# EAGLE design atmega1284_tactile2 (EAGLE 7.1.0)
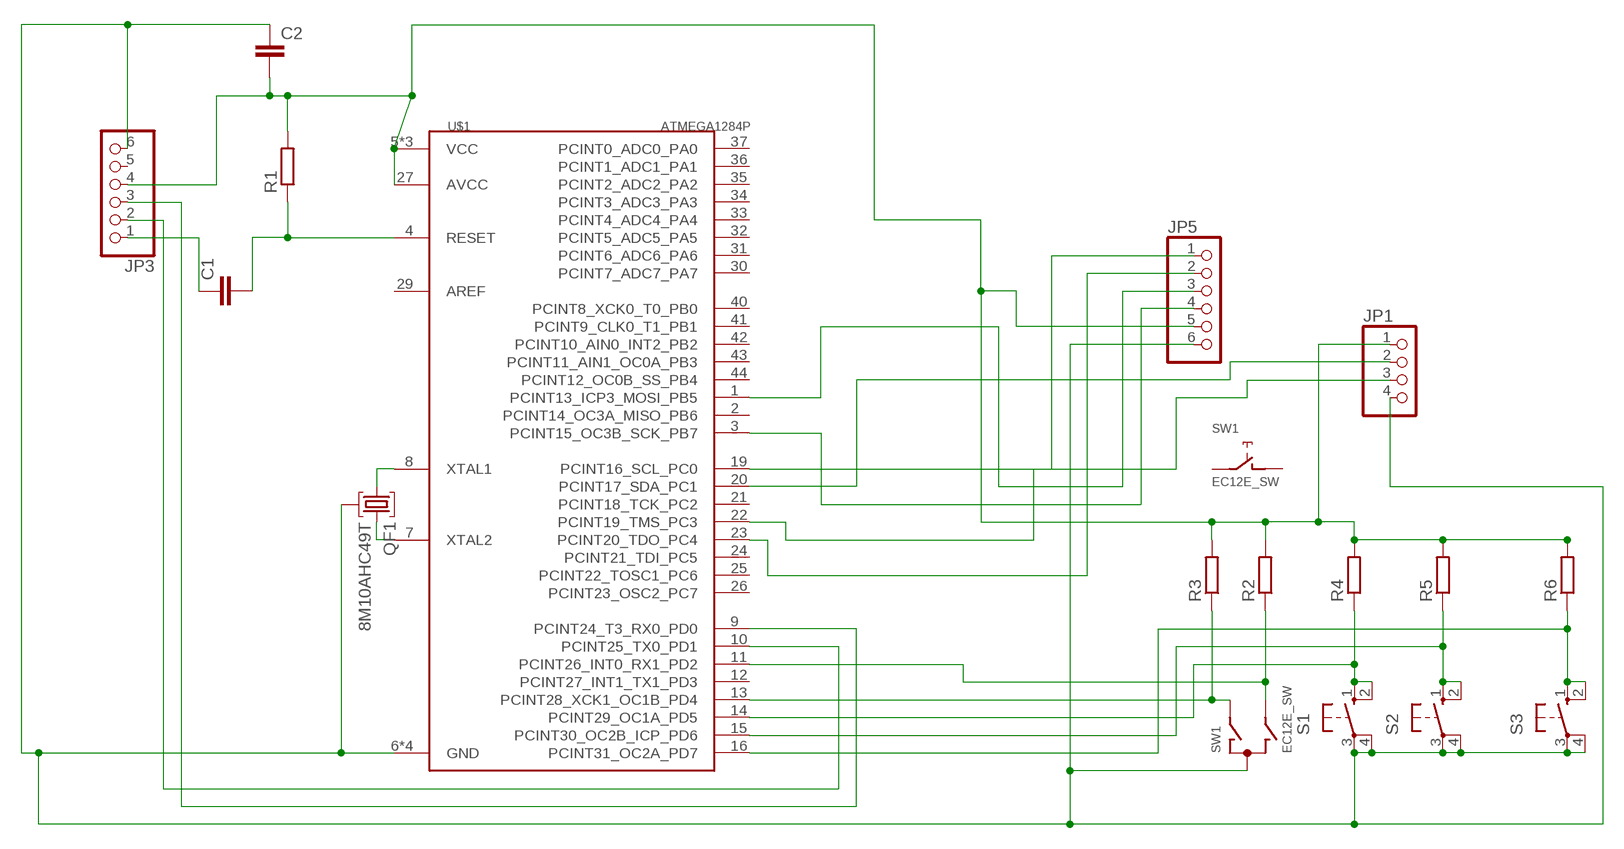
[diagram p0: schematic, sheet 1]

## Parts
C1  C-EUC0805  [C0805]
C2  C-EUC0805  [C0805]
JP1  PINHD-1X4  [1X04]
JP3  PINHD-1X6  [1X06]
JP5  PINHD-1X6  [1X06]
QF1  8M10AHC49T  [HC49U]
R1  R-EU_R0805  [R0805]
R2  R-EU_R0805  [R0805]
R3  R-EU_R0805  [R0805]
R4  R-EU_R0805  [R0805]
R5  R-EU_R0805  [R0805]
R6  R-EU_R0805  [R0805]
S1  10-XX  [B3F-10XX]
S2  10-XX  [B3F-10XX]
S3  10-XX  [B3F-10XX]
SW1  EC12E_SW  [ALPS_EC12E_SW]
U$1  ATMEGA1284P  [TQFP44]

## Nets
N$3: JP5.3 U$1.1(PCINT13_ICP3_MOSI_PB5)
N$5: QF1.1 U$1.8(XTAL1)
N$6: QF1.3 U$1.7(XTAL2)
N$7: C2.1 JP1.4 JP3.6 JP5.6 QF1.2 S1.3(P) S1.4(P1) S2.3(P) S2.4(P1) S3.3(P) S3.4(P1) SW1.C U$1.6(GND) U$1.18(GND) U$1.28(GND) U$1.39(GND)
N$8: JP5.4 U$1.3(PCINT15_OC3B_SCK_PB7)
N$9: R2.1 SW1.B U$1.11(PCINT26_INT0_RX1_PD2)
N$10: C1.2 R1.1 U$1.4(RESET)
N$11: C1.1 JP3.1
N$12: JP3.2 U$1.10(PCINT25_TX0_PD1)
N$13: JP3.3 U$1.9(PCINT24_T3_RX0_PD0)
N$14: JP5.1 U$1.22(PCINT19_TMS_PC3)
N$15: JP5.2 U$1.23(PCINT20_TDO_PC4)
N$16: R3.1 SW1.A U$1.13(PCINT28_XCK1_OC1B_PD4)
N$21: R4.1 S1.1(S) S1.2(S1) U$1.14(PCINT29_OC1A_PD5)
N$22: R5.1 S2.1(S) S2.2(S1) U$1.15(PCINT30_OC2B_ICP_PD6)
N$23: R6.1 S3.1(S) S3.2(S1) U$1.16(PCINT31_OC2A_PD7)
N$24: C2.2 JP1.1 JP3.4 JP5.5 R1.2 R2.2 R3.2 R4.2 R5.2 R6.2 U$1.5(VCC) U$1.17(VCC) U$1.27(AVCC) U$1.38(VCC)
N$29: JP1.2 U$1.20(PCINT17_SDA_PC1)
N$30: JP1.3 U$1.19(PCINT16_SCL_PC0)
Unconnected: JP3.5 SW1.D SW1.E SW1.GND1(G) SW1.GND2(G) U$1.2(PCINT14_OC3A_MISO_PB6) U$1.12(PCINT27_INT1_TX1_PD3) U$1.21(PCINT18_TCK_PC2) U$1.24(PCINT21_TDI_PC5) U$1.25(PCINT22_TOSC1_PC6) U$1.26(PCINT23_OSC2_PC7) U$1.29(AREF) U$1.30(PCINT7_ADC7_PA7) U$1.31(PCINT6_ADC6_PA6) U$1.32(PCINT5_ADC5_PA5) U$1.33(PCINT4_ADC4_PA4) U$1.34(PCINT3_ADC3_PA3) U$1.35(PCINT2_ADC2_PA2) U$1.36(PCINT1_ADC1_PA1) U$1.37(PCINT0_ADC0_PA0) U$1.40(PCINT8_XCK0_T0_PB0) U$1.41(PCINT9_CLK0_T1_PB1) U$1.42(PCINT10_AIN0_INT2_PB2) U$1.43(PCINT11_AIN1_OC0A_PB3) U$1.44(PCINT12_OC0B_SS_PB4)

## Library data of the parts
C1 C2 = rcl:C-EU: CAPACITOR, European symbol
JP1 = pinhead:PINHD-1X4: PIN HEADER
JP3 JP5 = pinhead:PINHD-1X6: PIN HEADER
QF1 = crystal:8M10AHC49T: Monolithic Crystal Filters Source: www.vanlong.com; OC_FARNELL: unknown; OC_NEWARK: unknown
R1-R6 = rcl:R-EU_: RESISTOR, European symbol
S1-S3 = switch-omron:10-XX: OMRON SWITCH; MPN: B3F-1000; OC_FARNELL: 176432; OC_NEWARK: 36M3542
SW1 = switch-alps:EC12E_SW: ALPS rotary Encoder EC12E series with switch; MPN: EC12E2424407; OC_FARNELL: 1520813; OC_NEWARK: 74M1068
U$1 = Stephanie_Parts:ATMEGA1284P: My version schematic & footprint for the ATMega1284P TQFP-44 package. Matches digikey part ATMEGA1284P-AU-ND. Tested & working.

## Board
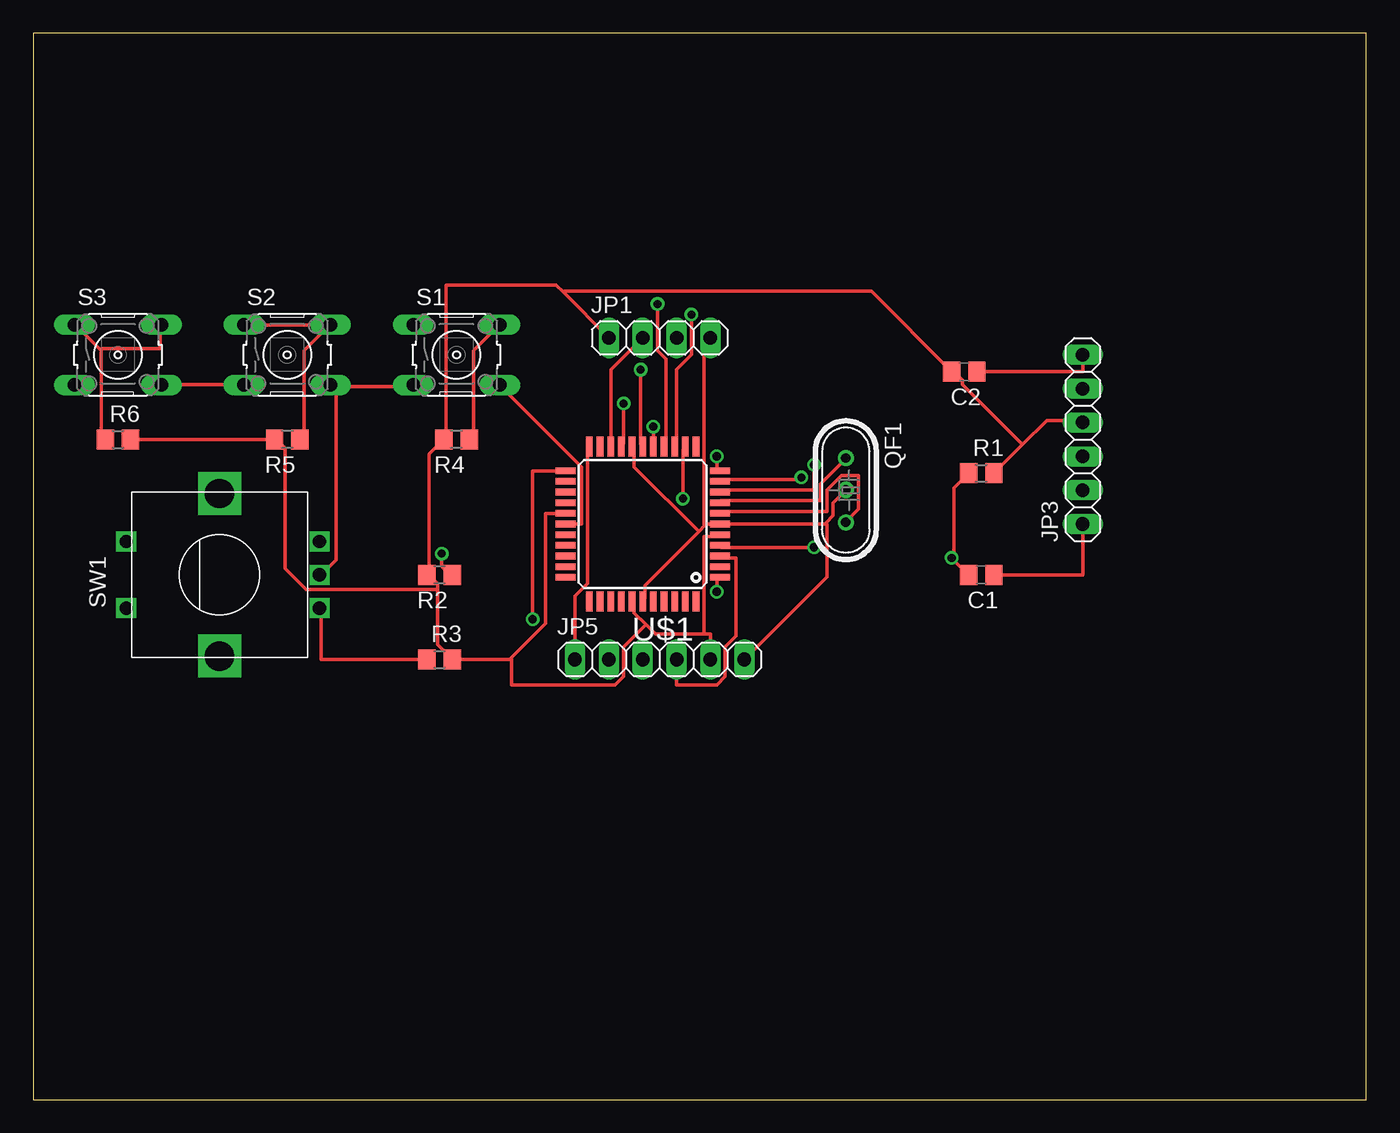
[diagram p1: board, top side]
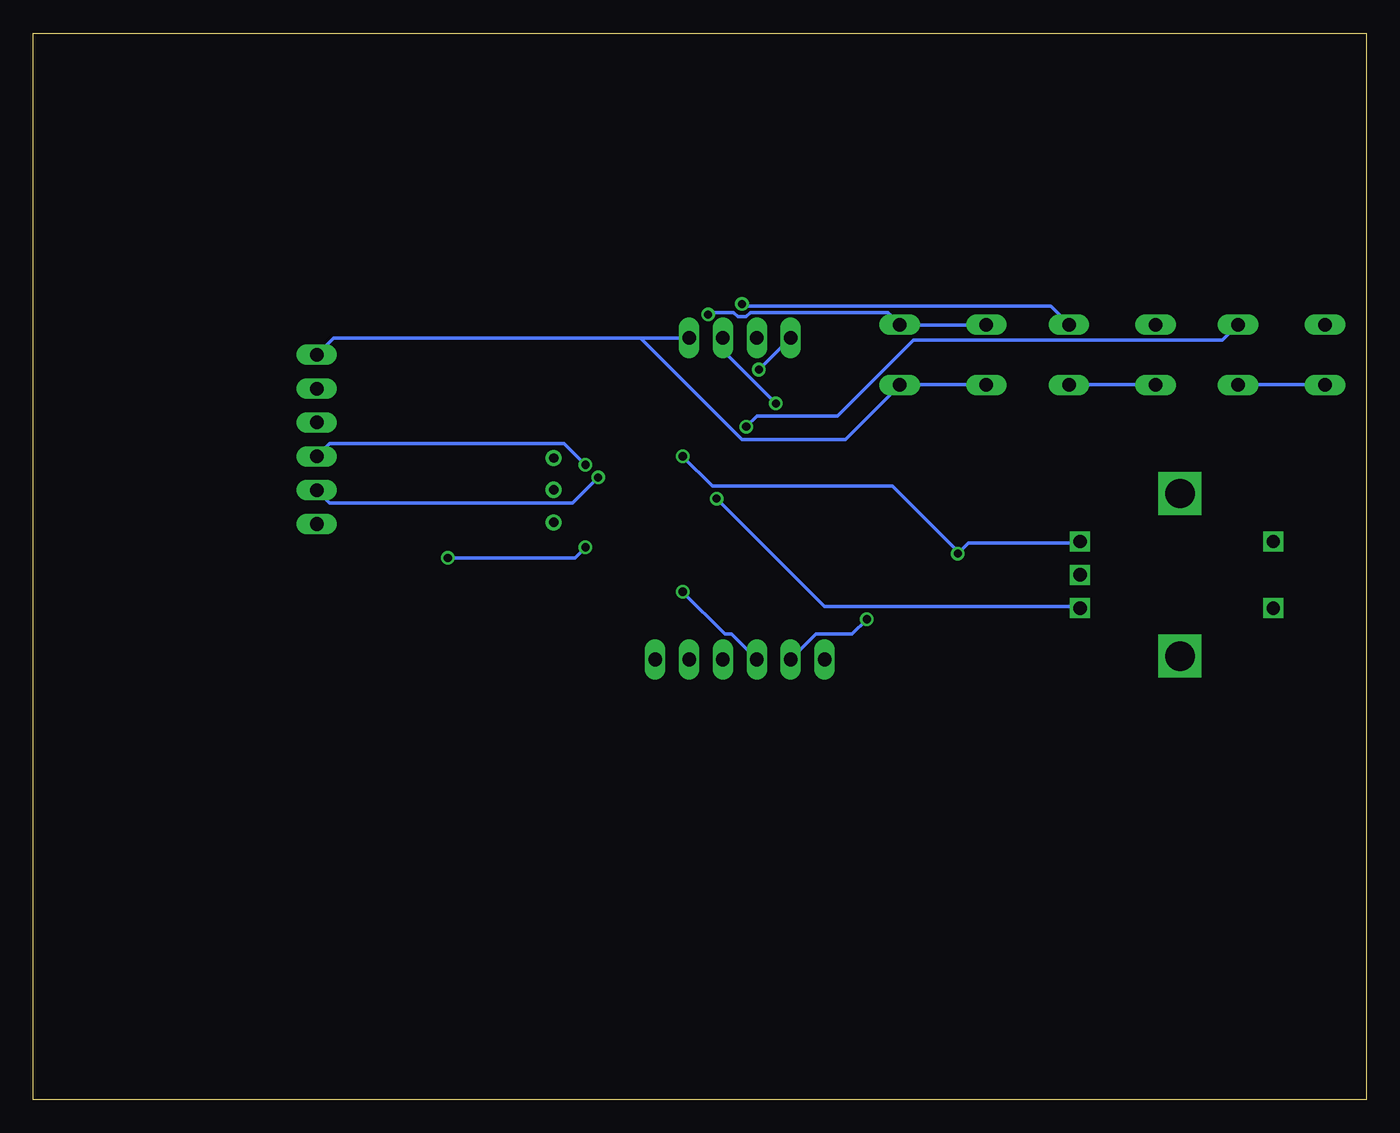
[diagram p2: board, bottom side, seen from below]

Size 100 x 80 mm. Coordinates in mm from the lower left corner, seen from the top.
Outline: 0,0 100,0 100,80 0,80 0,0
Copper layers (1*16): Top 0.035mm / dielectric 1.5mm / Bottom 0.035mm
Design rules "default": minimum track width 10mil, minimum drill 24mil, track to track 8mil, track to pad 8mil, pad to pad 8mil, via to via 8mil, smd to smd 8mil, copper to edge 40mil, drill to drill 8mil, minimum pad ring 10mil, minimum via ring 8mil, stop-mask expansion 4mil, vias tented up to drill 0mil, thermal gap 10mil

### Footprints (pad centres in the part's own frame; a part is rotated, then mirrored left to right if it is on the bottom)
C0805 = smd 1.3 x 1.5: 1 -0.95,0; 2 0.95,0
1X04 = drill 1.016 long: 1 -3.81,0; 2 -1.27,0; 3 1.27,0; 4 3.81,0
1X06 = drill 1.016 long: 1 -6.35,0; 2 -3.81,0; 3 -1.27,0; 4 1.27,0; 5 3.81,0; 6 6.35,0
HC49U = drill 0.7 pad 1.2: 1 -2.413,0; 2 -0.027,0; 3 2.413,0
R0805 = smd 1.3 x 1.5: 1 -0.95,0; 2 0.95,0
B3F-10XX = drill 1.016 long: 1 -3.251,2.261; 2 3.251,2.261; 3 -3.251,-2.261; 4 3.251,-2.261
ALPS_EC12E_SW = drill 1 square: A -2.5,-7.5; B 2.5,-7.5; C 0,-7.5; D -2.5,7; E 2.5,7 | drill 2.2 square: GND1 -6.1,0; GND2 6.1,0
TQFP44 = smd 1.5 x 0.5: 1 -5.8,4; 2 -5.8,3.2; 3 -5.8,2.4; 4 -5.8,1.6; 5 -5.8,0.8; 6 -5.8,0; 7 -5.8,-0.8; 8 -5.8,-1.6; 9 -5.8,-2.4; 10 -5.8,-3.2; 11 -5.8,-4; 23 5.8,-4; 24 5.8,-3.2; 25 5.8,-2.4; 26 5.8,-1.6; 27 5.8,-0.8; 28 5.8,0; 29 5.8,0.8; 30 5.8,1.6; 31 5.8,2.4; 32 5.8,3.2; 33 5.8,4 | smd 0.5 x 1.5: 12 -4,-5.8; 13 -3.2,-5.8; 14 -2.4,-5.8; 15 -1.6,-5.8; 16 -0.8,-5.8; 17 0,-5.8; 18 0.8,-5.8; 19 1.6,-5.8; 20 2.4,-5.8; 21 3.2,-5.8; 22 4,-5.8; 34 4,5.8; 35 3.2,5.8; 36 2.4,5.8; 37 1.6,5.8; 38 0.8,5.8; 39 0,5.8; 40 -0.8,5.8; 41 -1.6,5.8; 42 -2.4,5.8; 43 -3.2,5.8; 44 -4,5.8

### Placement (x,y rotation side)
C1  71.12,39.37 180 top
C2  69.85,54.61 180 top
JP1  46.99,57.15 0 top
JP3  78.74,49.53 90 top
JP5  46.99,33.02 0 top
QF1  60.96,45.72 270 top
R1  71.12,46.99 0 top
R2  30.48,39.37 180 top
R3  30.48,33.02 0 top
R4  31.75,49.53 180 top
R5  19.05,49.53 180 top
R6  6.35,49.53 0 top
S1  31.75,55.88 0 top
S2  19.05,55.88 0 top
S3  6.35,55.88 0 top
SW1  13.97,39.37 90 top
U$1  45.72,43.18 180 top

### Tracks (layer width: path | path; a pad name or v marks a point on that pad's centre or on a via)
N$3  (via drill 0.61)
  Top 0.254: v51.28,38.1 51.28,38.89 51.44,39.05 U$1.1
  Bottom 0.254: v51.28,38.1 48.1,34.92 47.62,34.92 JP5.3
N$5
  Top 0.254: U$1.8 51.59,44.93 59.05,44.93 59.05,46.2 60.96,48.1 QF1.1
N$6
  Top 0.254: U$1.7 51.59,44.13 59.53,44.13 59.53,45.72 60.64,46.83 61.91,46.83 61.91,44.29 60.96,43.34 QF1.3
N$7
  Top 0.254: U$1.28 41.12,43.18 41.12,47.47 35.08,53.5 S1.4 | S2.3 15.72,53.66 9.68,53.66 S3.4 | SW1.C 21.59,39.37 22.7,40.48 22.7,53.18 22.38,53.5 S2.4 22.54,53.5 28.42,53.5 S1.3 | C2.1 78.74,54.61 JP3.6 | 50.4,43.1 50.48,43.18 U$1.6 59.37,43.18 59.45,43.26 | 50.4,43.1 49.93,42.62 | 49.93,42.62 45.88,38.58 45.88,37.62 45.72,37.47 U$1.39 | 49.93,42.62 45.09,47.47 45.09,48.74 44.93,48.9 U$1.18 | 59.45,43.26 60.01,43.81 60.01,44.77 60.96,45.72 QF1.2 | JP5.6 59.53,39.21 59.53,43.18 59.45,43.26 | JP1.4 50.32,56.67 50.32,43.18 50.4,43.1
  Bottom 0.254: S3.3 3.17,53.66 9.53,53.66 S3.4 | S2.3 15.88,53.66 22.23,53.66 S2.4 | S1.3 28.57,53.66 34.92,53.66 S1.4 35.08,53.5 39.05,49.53 46.83,49.53 54.45,57.15 | JP3.6 77.47,57.15 54.45,57.15 | JP1.4 54.45,57.15
N$8
  Top 0.254: JP5.4 48.26,31.11 51.28,31.11 51.91,31.75 51.91,33.97 52.7,34.77 52.7,40.64 51.59,40.64 U$1.3
N$9  (via drill 0.61)
  Top 0.254: v30.64,40.96 30.64,40.01 31.27,39.37 R2.1 | v51.28,48.26 51.28,47.47 51.44,47.31 U$1.11
  Bottom 0.254: SW1.B 21.59,41.75 29.84,41.75 v30.64,40.96 30.64,41.12 35.56,46.04 49.05,46.04 v51.28,48.26
N$10  (via drill 0.61)
  Top 0.254: v58.58,41.43 51.59,41.43 U$1.4 | C1.2 v68.9,40.64 69.06,40.64 69.06,45.88 R1.1
  Bottom 0.254: v58.58,41.43 59.37,40.64 v68.9,40.64
N$11
  Top 0.254: C1.1 78.74,39.37 JP3.1
N$12  (via drill 0.61)
  Top 0.254: v57.63,46.67 57.63,46.51 51.59,46.51 U$1.10
  Bottom 0.254: v57.63,46.67 59.53,44.77 77.79,44.77 JP3.2
N$13  (via drill 0.61)
  Top 0.254: v58.58,47.62 58.58,45.72 51.59,45.72 U$1.9
  Bottom 0.254: v58.58,47.62 60.17,49.21 77.79,49.21 JP3.3
N$14
  Top 0.254: JP5.1 40.64,37.78 41.59,38.73 41.59,48.9 U$1.22
N$15  (via drill 0.61)
  Top 0.254: v37.47,36.04 37.47,47.15 39.85,47.15 U$1.23
  Bottom 0.254: v37.47,36.04 38.58,34.92 41.27,34.92 JP5.2
N$16  (via drill 0.61)
  Top 0.254: R3.1 21.59,33.02 21.59,36.83 SW1.A | v48.74,45.09 48.74,48.74 48.9,48.9 U$1.13
  Bottom 0.254: v48.74,45.09 40.64,36.99 21.59,36.99 SW1.A
N$21  (via drill 0.61)
  Top 0.254: R4.1 33.02,49.85 33.02,56.2 34.92,58.1 S1.2 | v49.37,58.9 49.37,55.88 48.26,54.77 48.26,49.05 U$1.14
  Bottom 0.254: v49.37,58.9 49.21,59.05 47.47,59.05 47.15,58.74 46.51,58.74 46.2,59.05 35.88,59.05 35.08,58.26 S1.2 34.92,58.1 28.57,58.1 S1.1
N$22  (via drill 0.61)
  Top 0.254: R5.1 20.32,49.85 20.32,56.2 22.23,58.1 S2.2 22.07,58.1 15.88,58.1 S2.1 | v46.83,59.69 46.83,56.2 47.47,55.56 47.47,49.05 U$1.15
  Bottom 0.254: v46.83,59.69 46.67,59.53 23.65,59.53 22.38,58.26 S2.2
N$23  (via drill 0.61)
  Top 0.254: 5,56.28 3.17,58.1 S3.1 | 5,56.28 5.08,56.2 5.08,49.85 R6.1 | v46.51,50.48 46.51,49.05 U$1.16 | 5,56.28 5.08,56.36 9.53,56.36 9.53,58.1 S3.2
  Bottom 0.254: v46.51,50.48 45.72,51.28 39.69,51.28 33.97,56.99 10.79,56.99 9.68,58.1 S3.2
N$24  (via drill 0.61)
  Top 0.254: 74.22,49.13 76.04,50.96 78.74,50.96 JP3.4 | 74.22,49.13 R1.2 | 74.22,49.13 69.69,53.66 69.69,53.98 69.06,54.61 C2.2 62.87,60.64 39.85,60.64 39.77,60.56 | 45.96,35.64 46.67,34.92 50.32,34.92 | 45.96,35.64 45.09,36.51 45.09,37.15 44.93,37.31 U$1.38 | 50.32,34.92 50.8,34.92 JP5.5 | 50.32,34.92 50.32,42.23 51.44,42.23 U$1.5 | v45.56,54.77 45.56,49.21 45.72,49.05 U$1.17 | R6.2 R5.2 18.26,49.53 18.89,48.9 18.89,39.85 20.48,38.26 30.32,38.26 | 29.69,39.37 30.32,38.73 30.32,38.26 | 30.32,38.26 30.32,34.13 31.27,33.18 31.27,33.02 R3.2 35.72,33.02 35.8,33.1 | 35.8,33.1 38.42,35.72 38.42,43.97 39.85,43.97 U$1.27 | 29.69,39.37 29.69,48.42 R4.2 30.96,49.53 30.96,61.12 39.21,61.12 39.77,60.56 | 29.69,39.37 R2.2 | 39.77,60.56 JP1.1 | 45.96,35.64 44.29,33.97 44.29,31.75 43.66,31.11 35.88,31.11 35.88,33.02 35.8,33.1
  Bottom 0.254: JP1.1 v45.56,54.77
N$29
  Top 0.254: JP1.2 43.34,54.77 43.34,49.05 U$1.20
N$30  (via drill 0.61)
  Top 0.254: v44.29,52.23 44.29,49.21 44.13,49.05 U$1.19
  Bottom 0.254: v44.29,52.23 48.26,56.2 JP1.3